# EAGLE schematic mpu6050-turtle (EAGLE 9.1.1)
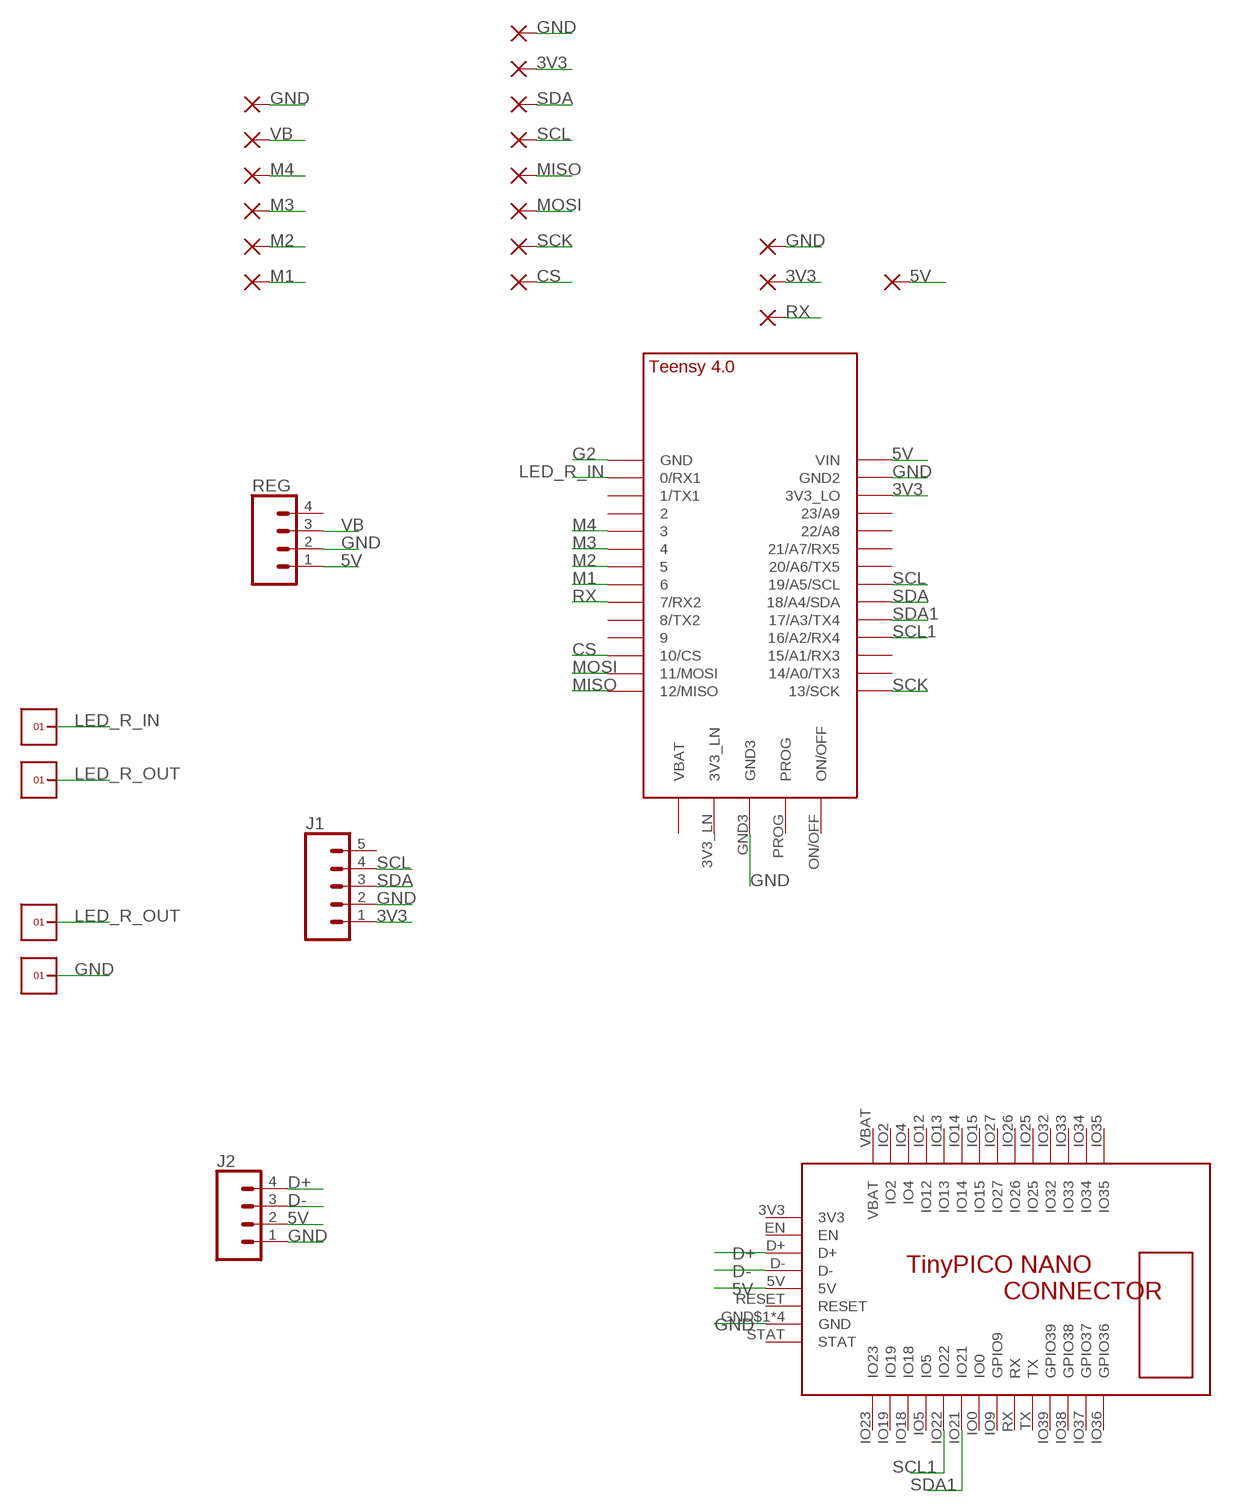
[diagram p0: schematic, sheet 1]

## Parts
3V  SMD2  [SMD1,27-2,54]
3V1  SMD2  [SMD1,27-2,54]
3V2  SMD2  [SMD1,27-2,54]
3V3  SMD2  [SMD1,27-2,54]
CS  SMD2  [SMD1,27-2,54]
GD  SMD2  [SMD1,27-2,54]
GD1  SMD2  [SMD1,27-2,54]
GD2  SMD2  [SMD1,27-2,54]
GND  SMD2  [SMD1,27-2,54]
J1  CONN_05NO_SILK  [1X05_NO_SILK]
J2  CONN_041X04_NO_SILK  [1X04_NO_SILK]
M1  SMD2  [SMD1,27-2,54]
M2  SMD2  [SMD1,27-2,54]
M3  SMD2  [SMD1,27-2,54]
M4  SMD2  [SMD1,27-2,54]
REG  CONN_041X04_NO_SILK  [1X04_NO_SILK]
RX  SMD2  [SMD1,27-2,54]
RX1  SMD2  [SMD1,27-2,54]
RX2  SMD2  [SMD1,27-2,54]
SCK  SMD2  [SMD1,27-2,54]
U$1  TEENSY_4.0  [TEENSY_4.0]
U$2  TINYPICO-NANO-CONNECTOR  [TINYPICO-NANO-CONNECTOR]
U$3  1X1  [1X1]
U$4  1X1  [1X1]
U$6  1X1  [1X1]
U$7  1X1  [1X1]
VBAT  SMD2  [SMD1,27-2,54]

## Nets
3V3: 3V2.1(P) 3V.1(P) J1.1 U$1.3V3_LO
5V: 3V1.1(P) J2.2 REG.1 U$1.VIN U$2.5V
CS: CS.1(P) U$1.10/CS
D+: J2.4 U$2.D+
D-: J2.3 U$2.D-
G2: U$1.GND
GND: GD1.1(P) GD.1(P) GND.1(P) J1.2 J2.1 REG.2 U$1.GND2 U$1.GND3 U$2.GND$1(GND) U$2.GND$2(GND) U$2.GND$3(GND) U$2.GND$4(GND) U$7.1
LED_R_IN: U$1.0/RX(0/RX1) U$3.1
LED_R_OUT: U$4.1 U$6.1
M1: M1.1(P) U$1.6
M2: M2.1(P) U$1.5
M3: M3.1(P) U$1.4/CANRX
M4: M4.1(P) U$1.3/CANTX
MISO: 3V3.1(P) U$1.12/MISO
MOSI: RX2.1(P) U$1.11/MOSI
RX: RX.1(P) U$1.7(7/RX2)
SCK: SCK.1(P) U$1.13/SCK
SCL: GD2.1(P) J1.4 U$1.19/A5/SCL
SCL1: U$1.16/A2(16/A2/RX4) U$2.IO22
SDA: J1.3 RX1.1(P) U$1.18/A4/SDA
SDA1: U$1.17/A3(17/A3/TX4) U$2.IO21
VB: REG.3 VBAT.1(P)
Unconnected: J1.5 REG.4 U$1.1/TX(1/TX1) U$1.2 U$1.3V3_LN U$1.8(8/TX2) U$1.9/CS U$1.14/A0(14/A0/TX3) U$1.15/A1(15/A1/RX3) U$1.20/A6(20/A6/TX5) U$1.21/A7(21/A7/RX5) U$1.22/A8 U$1.23/A9 U$1.ON/OFF U$1.PROG U$1.VBAT\(VBAT) U$2.EN U$2.IO0 U$2.IO2 U$2.IO4 U$2.IO5 U$2.IO9(GPIO9) U$2.IO12 U$2.IO13 U$2.IO14 U$2.IO15 U$2.IO18 U$2.IO19 U$2.IO23 U$2.IO25 U$2.IO26 U$2.IO27 U$2.IO32 U$2.IO33 U$2.IO34 U$2.IO35 U$2.IO36(GPIO36) U$2.IO37(GPIO37) U$2.IO38(GPIO38) U$2.IO39(GPIO39) U$2.RESET U$2.RX U$2.STAT U$2.TX

## Power pins joined to a net without a drawn wire
3V3: U$2.3V3
VBAT: U$2.VBAT

## Library data of the parts
3V 3V1-3V3 CS GD GD1 GD2 GND M1-M4 RX RX1 RX2 SCK VBAT = wirepad:SMD2: SMD PAD
J1 = SparkFun-Connectors:CONN_05: Multi connection point. Often used as Generic Header-pin footprint for 0.1 inch spaced/style header connections On any of the 0.1 inch spaced packages, you can populate with these: Break Away Headers - Straight <https://www.sparkfun.com/products/116> (PRT-00116) Break Away Male Headers - Right Angle <https://www.sparkfun.com/products/553> (PRT-00553) Female Headers <https://www.sparkfun.com/products/115> (PRT-00115) Break Away Headers - Machine Pin <https://www.sparkfun.com/products/117> (PRT-00117) Break Away Female Headers - Swiss Machine Pin <https://www.sparkfun.com/products/743> (PRT-00743) For SCREWTERMINALS and SPRING TERMINALS visit here: Screw Terimnals on SparkFun.com <https://www.sparkfun.com/search/results?term=Screw+Terminals> (5mm/3.5mm/2.54mm spacing) This device is also useful as a general connection point to wire up your design to another part of your project. Our various solder wires solder well into these plated through hole pads. Hook-Up Wire - Assortment (Stranded, 22 AWG) <https://www.sparkfun.com/products/11375> (PRT-11375) Hook-Up Wire - Assortment (Solid Core, 22 AWG) <https://www.sparkfun.com/products/11367> (PRT-11367) View the entire wire category on our website here <https://www.sparkfun.com/categories/141> Special notes: Molex polarized connector foot print use with SKU : PRT-08231 with associated crimp pins and housings. 1MM SMD Version SKU: PRT-10208
J2 REG = SparkFun-Connectors:CONN_04: Multi connection point. Often used as Generic Header-pin footprint for 0.1 inch spaced/style header connections On any of the 0.1 inch spaced packages, you can populate with these: Break Away Headers - Straight <https://www.sparkfun.com/products/116> (PRT-00116) Break Away Male Headers - Right Angle <https://www.sparkfun.com/products/553> (PRT-00553) Female Headers <https://www.sparkfun.com/products/115> (PRT-00115) Break Away Headers - Machine Pin <https://www.sparkfun.com/products/117> (PRT-00117) Break Away Female Headers - Swiss Machine Pin <https://www.sparkfun.com/products/743> (PRT-00743) For SCREWTERMINALS and SPRING TERMINALS visit here: Screw Terimnals on SparkFun.com <https://www.sparkfun.com/search/results?term=Screw+Terminals> (5mm/3.5mm/2.54mm spacing) This device is also useful as a general connection point to wire up your design to another part of your project. Our various solder wires solder well into these plated through hole pads. Hook-Up Wire - Assortment (Stranded, 22 AWG) <https://www.sparkfun.com/products/11375> (PRT-11375) Hook-Up Wire - Assortment (Solid Core, 22 AWG) <https://www.sparkfun.com/products/11367> (PRT-11367) View the entire wire category on our website here <https://www.sparkfun.com/categories/141> Special notes: Molex polarized connector foot print use with SKU : PRT-08231 with associated crimp pins and housings. 1MM SMD Version SKU: PRT-10208; PROD_ID: CONN-09696
U$1 = TEENSY 4.0:TEENSY_4.0
U$2 = TinyPICO_NANO_Eagle:TINYPICO-NANO-CONNECTOR: TinyPICO NANO Footprint https://www.tinypico.com/tinypico-nano
U$3 U$4 U$6 U$7 = headers(2mm):1X1